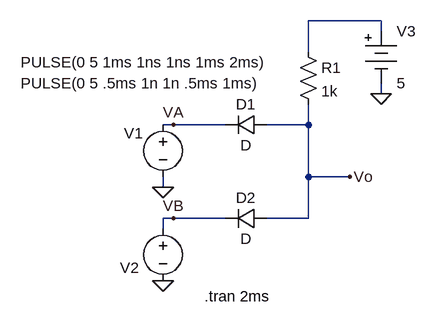
[diagram p0: schematic DASE TP 2 PUNTO 6.asc]
DASE TP 2 PUNTO 6.asc, the LTspice schematic file:
Version 4
SHEET 1 880 680
WIRE 400 -48 288 -48
WIRE 400 -32 400 -48
WIRE 288 0 288 -48
WIRE 400 64 400 48
WIRE 80 112 64 112
WIRE 160 112 80 112
WIRE 288 112 288 80
WIRE 288 112 224 112
WIRE 288 192 288 112
WIRE 352 192 288 192
WIRE 64 208 64 192
WIRE 80 256 64 256
WIRE 160 256 80 256
WIRE 288 256 288 192
WIRE 288 256 224 256
WIRE 64 272 64 256
FLAG 352 192 Vo
FLAG 64 208 0
FLAG 64 352 0
FLAG 80 112 VA
FLAG 80 256 VB
FLAG 400 64 0
SYMBOL voltage 64 96 R0
WINDOW 0 -60 29 Left 2
WINDOW 3 -219 -48 Left 2
WINDOW 123 0 0 Left 0
WINDOW 39 0 0 Left 0
SYMATTR InstName V1
SYMATTR Value PULSE(0 5 .5ms 1n 1n .5ms 1ms)
SYMBOL voltage 64 256 R0
WINDOW 0 -66 76 Left 2
WINDOW 3 -219 -240 Left 2
WINDOW 123 0 0 Left 0
WINDOW 39 0 0 Left 0
SYMATTR InstName V2
SYMATTR Value PULSE(0 5 1ms 1ns 1ns 1ms 2ms)
SYMBOL diode 224 96 R90
WINDOW 0 0 32 VBottom 2
WINDOW 3 32 32 VTop 2
SYMATTR InstName D1
SYMBOL diode 224 240 R90
WINDOW 0 0 32 VBottom 2
WINDOW 3 32 32 VTop 2
SYMATTR InstName D2
SYMBOL res 272 -16 R0
SYMATTR InstName R1
SYMATTR Value 1k
SYMBOL Misc\\battery 400 -48 R0
SYMATTR InstName V3
SYMATTR Value 5
TEXT 128 376 Left 2 !.tran 2ms

The netlist it stands for:
* DASE TP 2 PUNTO 6.asc
V1 VA 0 PULSE(0 5 .5ms 1n 1n .5ms 1ms)
V2 VB 0 PULSE(0 5 1ms 1ns 1ns 1ms 2ms)
D1 Vo VA D
D2 Vo VB D
R1 N001 Vo 1k
V3 N001 0 5
.model D D
.lib standard.dio
.tran 2ms
.backanno
.end